# EasyEDA Pro project PCB.epro

# Board PCB1
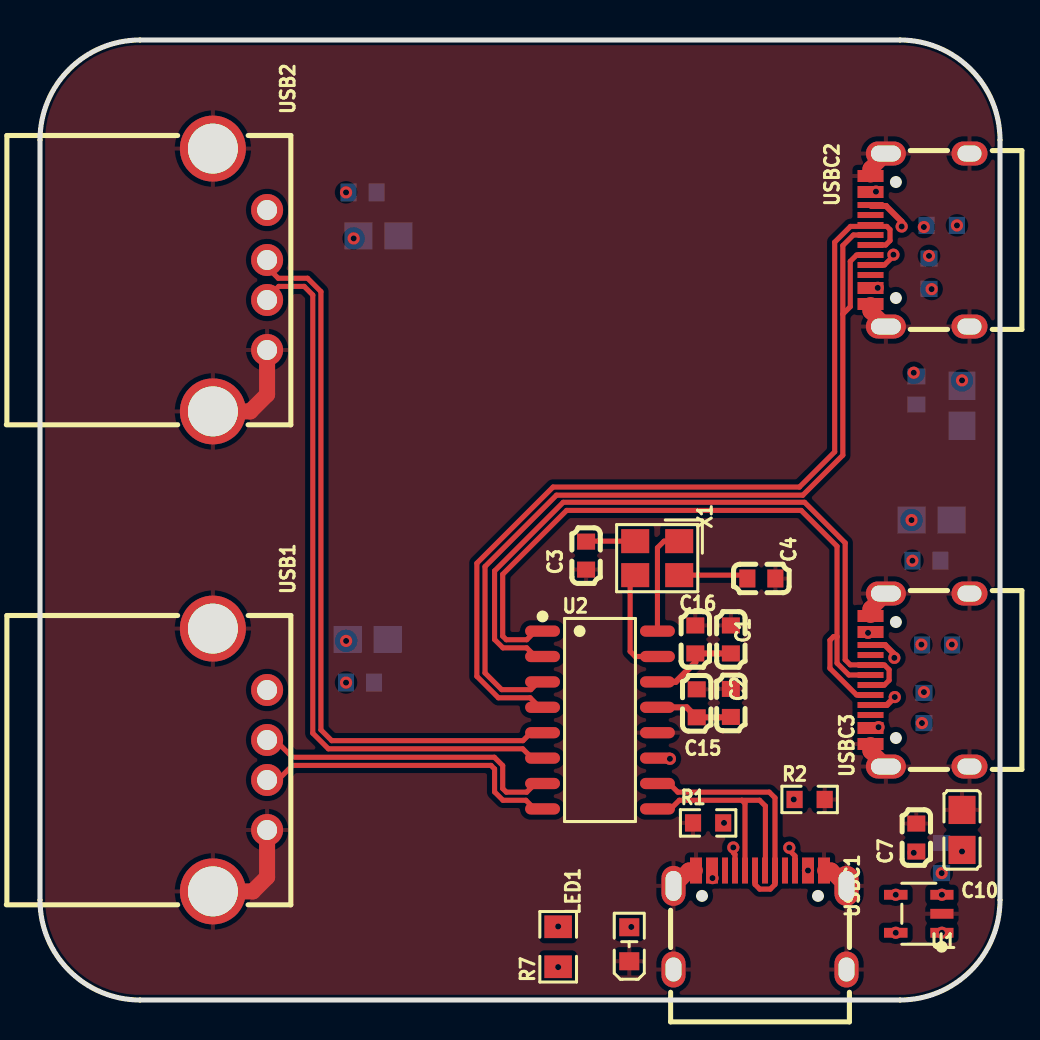
[diagram p0: board, top side]
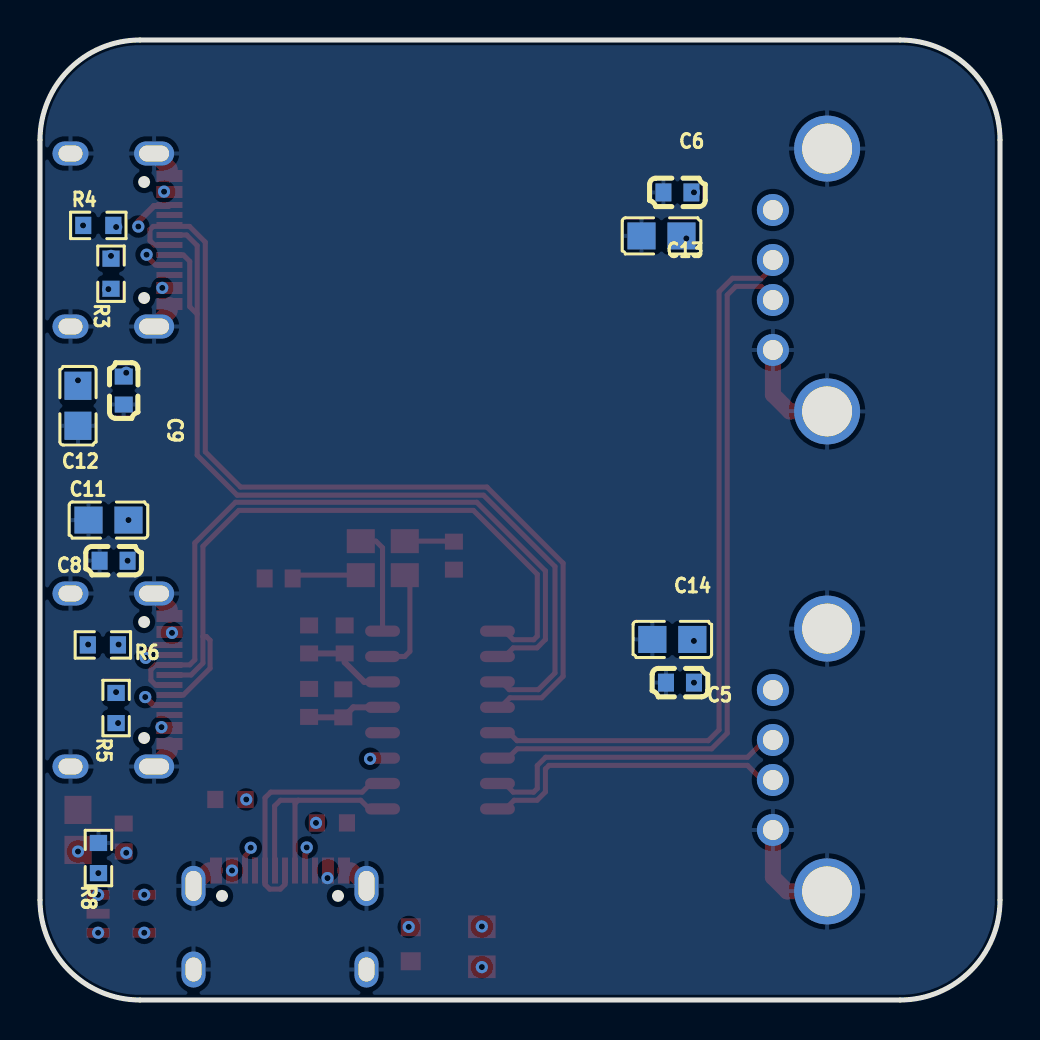
[diagram p1: board, bottom side, seen from below]

Outline 48 x 48 mm; copper layers: Top Layer, Inner1, Inner2, Bottom Layer. Coordinates in mm from the lower left corner of the outline.
Outline path: 0,43 0,5 arc(1.46,1.46) 5,0 43,0 arc(46.54,1.46) 48,5 48,43 arc(46.54,46.54) 43,48 5,48 arc(1.46,46.54) 0,43
Stack: Top Layer 0.035mm Outer layer thickness 1oz / Dielectric1 0.2104mm 7628 RC49% 8.6mil / Inner1 0.0152mm Inner layer thickness / Dielectric2 1.065mm 1.1mm H/HOZ Copper / Inner2 0.0152mm Inner layer thickness / Dielectric3 0.2104mm 7628 RC49% 8.6mil / Bottom Layer 0.035mm Outer layer thickness 1oz

## Design rules (mm)
net D+: DP1
net D-: DP1
net DP4: DP2
net DM4: DP2
net DP3: DP3
net DM3: DP3
net DP1: DP4
net DM1: DP4
net DP2: DP5
net DM2: DP5
spacing copperThickness1oz (default): track to track 0.102, other pairs 0.152 to 0.3
spacing copperThickness2oz: track to track 0.203, other pairs 0.152 to 0.3
track width copperThickness1oz (default): min 0.127, default 0.254, max 2.54
track width copperThickness2oz: min 0.203, default 0.254, max 2.54
differential pair differentialPair (default): width min 0.127, default 0.254, max 2.54; gap min 0.152, default 0.152
net GND uses copperRegion

## Placement (name value [footprint] x y rotation side)
C1  10uF  [C0603]  34.54 18.03 90 top
C2  10uF  [C0603]  34.54 14.85 90 top
C3  15pF  [C0603]  27.31 22.22 90 top
C4  15pF  [C0603]  36.07 21.08 0 top
C5  100nF  [C0603]  16 15.87 0 bottom
C6  100nF  [C0603]  16.13 40.38 0 bottom
C7  100nF  [C0603]  43.81 8.12 270 top
C8  100nF  [C0603]  44.32 21.97 180 bottom
C9  100nF  [C0603]  43.81 30.47 90 bottom
C10  10uF  [C0805]  46.1 8.5 270 top
C11  10uF  [C0805]  44.58 24 180 bottom
C12  10uF  [C0805]  46.1 29.71 90 bottom
C13  10uF  [C0805]  16.92 38.2 0 bottom
C14  10uF  [C0805]  16.38 18.03 0 bottom
C15  100nF  [C0603]  32.84 14.83 270 top
C16  100nF  [C0603]  32.77 18.03 270 top
LED1  A-SP192DGHC-C01-4T  [LED0603-FD]  29.46 2.79 270 top
R1  5.1kΩ  [R0603]  33.41 8.85 0 top
R2  5.1kΩ  [R0603]  38.48 10.03 0 top
R3  56kΩ  [R0603]  44.45 36.32 90 bottom
R4  56kΩ  [R0603]  45.09 38.73 180 bottom
R5  56kΩ  [R0603]  44.2 14.6 90 bottom
R6  56kΩ  [R0603]  44.86 17.75 180 bottom
R7  1kΩ  [R0805]  25.91 2.66 90 top
R8  4.7kΩ  [R0603]  45.08 7.1 90 bottom
U1  SY6280AAC  [SOT-23-5_L3.0-W1.7-P0.95-LS2.8-BL]  43.94 4.31 90 top
U2  SL2.1A  [SOP-16_L10.0-W3.9-P1.27-LS6.0-BL]  28 14 270 top
USB1  USB-231-ARY  [USB-A-TH_USB-231-ARY]  10 12 270 top
USB2  USB-231-ARY  [USB-A-TH_USB-231-ARY]  10 36 270 top
USBC1  TYPE-C-31-M-12  [USB-C_SMD-TYPE-C-31-M-12_1]  36 4 0 top
USBC2  TYPE-C-31-M-12  [USB-C_SMD-TYPE-C-31-M-12_1]  44 38 90 top
USBC3  TYPE-C-31-M-12  [USB-C_SMD-TYPE-C-31-M-12_1]  44 16 90 top
X1  12MHz  [CRYSTAL-SMD_4P-L3.2-W2.5-BL]  30.86 22.09 180 top

## Footprints (pads in the part's own frame, mm; a bottom-side part is the same pattern mirrored in y, then rotated)
C0603
  rect 0.8x0.9 smd: 1(-0.7,0) 2(0.7,0)
C0805
  rect 1.41x1.35 smd: 1(-1,0) 2(1,0)
CRYSTAL-SMD_4P-L3.2-W2.5-BL
  rect 1.4x1.2 smd: 1(-1.1,-0.85) 2(1.1,-0.85) 3(1.1,0.85) 4(-1.1,0.85)
LED0603-FD
  rect 0.9x1 smd: 1(-0.85,0) 2(0.85,0)
R0603
  rect 0.806x0.864 smd: 1(-0.753,0) 2(0.753,0)
R0805
  rect 1.133x1.377 smd: 1(-1,0) 2(1,0)
SOP-16_L10.0-W3.9-P1.27-LS6.0-BL
  oval 0.56x1.745 smd: 1(-4.445,-2.873) 2(-3.175,-2.873) 3(-1.905,-2.873) 4(-0.635,-2.873) 5(0.635,-2.873) 6(1.905,-2.873) 7(3.175,-2.873) 8(4.445,-2.873) 9(4.445,2.873) 10(3.175,2.873) 11(1.905,2.873) 12(0.635,2.873) 13(-0.635,2.873) 14(-1.905,2.873) 15(-3.175,2.873) 16(-4.445,2.873)
SOT-23-5_L3.0-W1.7-P0.95-LS2.8-BL
  rect 0.49x1.157 smd: 1(-0.95,-1.153) 2(0,-1.153) 3(0.95,-1.153)
  rect 0.49x1.175 smd: 4(0.95,1.153) 5(-0.95,1.153)
USB-A-TH_USB-231-ARY
  round 1.6 hole 1: 1(-3.5,1.355) 2(-1,1.355) 3(1,1.355) 4(3.5,1.355)
  round 3.3 hole 2.5: 5(-6.57,-1.355) 6(6.57,-1.355)
USB-C_SMD-TYPE-C-31-M-12_1
  oval 1.2x2 hole 0.8x1.5: 1(4.325,1.706) 4(-4.325,1.706)
  oval 1.2x1.8 hole 0.8x1.2: 2(4.325,-2.474) 3(-4.325,-2.474)
  custom 0.6x1.3 smd: A1B12(-3.2,2.474) A4B9(-2.4,2.474) B1A12(3.2,2.474) B4A9(2.401,2.474)
  rect 0.3x1.3 smd: A5(-1.25,2.474) A6(-0.25,2.474) A7(0.25,2.474) A8(1.25,2.474) B5(1.75,2.474) B6(0.75,2.474) B7(-0.75,2.474) B8(-1.75,2.474)

## Nets
+5V: C5.1 C6.1 C7.2 C8.2 C9.2 C10.2 C11.2 C12.2 C13.1 C14.1 R3.1 R4.1 R5.1 R6.1 R7.1 U1.1 U2.11 USB1.1 USB2.1 USBC2.A4B9 USBC2.B4A9 USBC3.A4B9 USBC3.B4A9
GND: C1.2 C2.2 C3.1 C4.2 C5.2 C6.2 C7.1 C8.1 C9.1 C10.1 C11.1 C12.1 C13.2 C14.2 C15.1 C16.1 LED1.2 R1.1 R2.2 R8.2 U1.2 U2.12 USB1.4 USB1.5 USB1.6 USB2.4 USB2.5 USB2.6 USBC1.1 USBC1.2 USBC1.3 USBC1.4 USBC1.A1B12 USBC1.B1A12 USBC2.1 USBC2.2 USBC2.3 USBC2.4 USBC2.A1B12 USBC2.B1A12 USBC3.1 USBC3.2 USBC3.3 USBC3.4 USBC3.A1B12 USBC3.B1A12
D+: U2.10 USBC1.A6 USBC1.B6
D-: U2.9 USBC1.A7 USBC1.B7
DM1: U2.7 USB1.2
DM2: U2.5 USB2.2
DM3: U2.3 USBC2.A7 USBC2.B7
DM4: U2.1 USBC3.A7 USBC3.B7
DP1: U2.8 USB1.3
DP2: U2.6 USB2.3
DP3: U2.4 USBC2.A6 USBC2.B6
DP4: U2.2 USBC3.A6 USBC3.B6
$1N151: C1.1 C16.2 U2.14
$1N152: C2.1 C15.2 U2.13
$1N156: U2.15 X1.3
$1N157: U2.16 X1.1
$1N158: C4.1 X1.4
$1N159: C3.2 X1.2
$1N181: R1.2 USBC1.A5
$1N182: R2.1 USBC1.B5
$1N206: R4.2 USBC2.B5
$1N207: R3.2 USBC2.A5
$1N223: R6.2 USBC3.B5
$1N224: R5.2 USBC3.A5
$1N239: LED1.1 R7.2
$1N246: U1.4 U1.5 USBC1.A4B9 USBC1.B4A9
$1N248: R8.1 U1.3

Pads without a net: USBC1 A8 B8; USBC2 A8 B8; USBC3 A8 B8

## Via types
v1: diameter 0.61, hole 0.305, Top Layer to Bottom Layer, 41 vias

## Routing (per net, layer and track width the routed paths; a pad name or vN(x,y) marks a point on that pad's centre or on a via; arc(x,y) is an arc through that point)
+5V: length 237.8
  Inner2 w0.8: 33.66,25.78 34.16,26.28 39.44,26.28 ; 33.66,25.78 33.66,29.97 33.09,30.53 28.12,30.53 28.07,30.48 ; 33.66,25.78 32.38,24.5 21.21,24.5 19.75,23.05 19.75,8.69 21.52,6.92 22.79,6.92 ; 22.79,6.92 27.5,6.92 28.07,7.49 28.07,11.17 28.96,12.06 v1(31.5,12.06) 37.08,12.06 39.62,9.52 42.29,9.52 42.7,9.11 42.7,8.35 v1(43.69,7.36) 43.75,7.43 v1(46.1,7.43) 46.54,7.43 47.12,6.85 47.12,3.93 46.55,3.36 v1(45.1,3.36) ; 22.79,6.92 22.79,2.48 23.62,1.64 v1(25.91,1.64) ; 38.74,37.81 37.05,37.81 36.19,36.95 36.19,32.89 37.72,31.36 v1(43.69,31.36) 45.72,31.36 v1(46.1,30.98) 46.1,27.08 45.3,26.28 39.44,26.28 ; 38.74,37.81 38.74,39.62 39.54,40.42 v1(41.8,40.42) 41.86,40.42 42.38,39.9 45.31,39.9 45.85,39.36 v1(45.85,38.73) ; 38.74,37.81 38.74,36.44 39.57,35.61 v1(41.89,35.61) 42.38,36.1 43.21,36.1 43.76,35.54 v1(44.58,35.54) ; v1(15.68,38.08) 15.68,40 v1(15.3,40.38) 15.05,40.63 12.06,40.63 11.35,39.92 USB2.1 ; 39.44,26.28 39.69,26.04 39.69,23.95 43.53,23.95 v1(43.58,24) 43.58,22.01 v1(43.62,21.97) 37.47,21.97 36.58,21.08 36.58,16.89 37.34,16.12 38.48,16.12 ; v1(44.1,13.85) 43.82,14.13 42.41,14.13 v1(41.93,13.64) ; v1(41.4,18.36) 41.4,18.28 ; 41.4,18.28 41.72,17.96 41.72,16.82 42.29,16.25 44.83,16.25 45.59,17.01 v1(45.59,17.77) ; 41.4,18.28 39.37,18.28 38.8,17.71 38.8,14.54 39.75,13.58 41.87,13.58 ; 28.07,30.48 28.07,31.62 27.18,32.51 16.55,32.51 15.75,33.31 15.75,37.84 ; 28.07,30.48 28.07,27.59 27.4,26.92 16.38,26.92 15.31,25.84 v1(15.31,17.95) 15.31,15.87 v1(15.3,15.87) 14.93,15.5 USB1.1
GND: length 19
  Top Layer w0.8: USBC3.4 41.53,12.44 41.53,12.75 ; USB1.4 11.35,6.14 10.64,5.43 USB1.6 ; USBC1.4 32.44,6.47 32.74,6.47 ; USB2.6 10.51,29.43 11.35,30.27 USB2.4 ; 41.53,34.75 41.53,34.44 USBC2.4 ; USBC3.1 41.53,19.56 41.53,19.25 ; USBC1.1 39.56,6.47 39.26,6.47 ; 41.53,41.28 41.53,41.56 USBC2.1
D+: length 12.4
  Top Layer w0.254: U2.10 31.46,10.83 31.89,10.39 36.46,10.39 36.75,10.11 USBC1.B6 36.75,5.78 36.52,5.55 35.98,5.55 35.75,5.78 USBC1.A6
D-: length 12.5
  Top Layer w0.254: USBC1.B7 35.25,9.83 35.09,9.99 ; U2.9 31.53,9.56 31.96,9.99 35.09,9.99 ; 35.09,9.99 35.98,9.99 36.27,9.7 36.27,6.49 USBC1.A7
DM1: length 15.7
  Top Layer w0.254: U2.7 24.77,10.83 24.34,10.39 23.31,10.39 23.14,10.57 23.14,11.72 22.72,12.14 12.62,12.14 11.76,13 USB1.2
DM2: length 36.9
  Top Layer w0.254: U2.5 24.55,13.36 24.15,12.97 14.59,12.97 14.05,13.51 14.05,35.42 13.38,36.09 11.91,36.09 11.35,36.64 USB2.2
DM3: length 44.9
  Top Layer w0.254: U2.3 24.93,15.91 24.54,15.52 23.08,15.52 22.25,16.35 22.25,21.67 25.82,25.24 38.14,25.24 40.14,27.24 40.14,34.29 ; USBC2.B7 40.83,37.25 40.51,36.93 40.51,34.67 40.14,34.29 ; 40.14,34.29 40.14,37.72 40.67,38.25 USBC2.A7
DM4: length 36.2
  Top Layer w0.254: 39.85,18.17 39.68,18.17 39.5,17.99 39.5,16.58 40.83,15.25 USBC3.B7 ; 39.85,18.17 39.85,22.69 38.06,24.48 26.33,24.48 23.14,21.28 23.14,18.19 23.31,18.01 24.34,18.01 24.77,18.44 U2.1 ; 39.85,18.17 39.85,16.84 40.45,16.25 41.38,16.25
DP1: length 15.6
  Top Layer w0.254: USB1.3 11.9,11 12.63,11.73 22.55,11.73 22.73,11.55 22.73,10.4 23.15,9.99 24.29,9.99 24.72,9.56 U2.8
DP2: length 36.7
  Top Layer w0.254: USB2.3 11.35,35.1 11.94,35.68 13.21,35.68 13.64,35.25 13.64,13.34 14.42,12.56 24.14,12.56 24.6,12.09 U2.6
DP3: length 45
  Top Layer w0.254: U2.4 24.98,14.64 24.51,15.11 22.92,15.11 21.84,16.18 21.84,21.84 25.65,25.65 37.97,25.65 39.74,27.41 39.74,37.89 40.52,38.68 42.34,38.68 42.5,38.52 42.5,37.97 42.28,37.75 USBC2.A6
DP4: length 36.2
  Top Layer w0.254: USBC3.A6 41.53,15.74 42.21,15.74 42.46,15.98 42.46,16.52 42.22,16.75 USBC3.B6 ; U2.2 24.77,17.17 24.34,17.61 23.15,17.61 22.73,18.02 22.73,21.45 26.16,24.89 38.23,24.89 40.26,22.85 40.26,17.01 40.51,16.76 41.93,16.76
$1N151: length 4.5
  Top Layer w0.3: U2.14 31.79,15.91 32.77,16.89 C16.2 C1.1
$1N152: length 3.9
  Top Layer w0.3: U2.13 32.33,14.64 C15.2 34.53,14.13 C2.1
$1N156: length 5.4
  Top Layer w0.254: X1.3 29.51,20.99 29.51,17.43 29.76,17.17 U2.15
$1N157: length 5.4
  Top Layer w0.254: X1.1 31.2,22.94 30.87,22.61 U2.16
$1N158: length 3.5
  Top Layer w0.254: X1.4 35.2,21.24 C4.1
$1N159: length 2.5
  Top Layer w0.254: C3.2 27.33,22.94 X1.2
$1N181: length 2.6
  Top Layer w0.254: v1(34.66,7.63) 34.66,7.37 34.75,7.28 USBC1.A5
  Inner2 w0.6: v1(34.2,8.85) 34.2,8.09 v1(34.66,7.63)
$1N182: length 3.9
  Top Layer w0.254: USBC1.B5 37.75,7.2 37.47,7.49 v1(37.47,7.61)
  Inner2 w0.6: v1(37.47,7.61) 37.34,7.74 37.34,9.68 v1(37.69,10.03)
$1N206: length 3.3
  Top Layer w0.3: USBC2.B5 41.57,39.7 42.3,39.7 43.08,38.92 v1(43.08,38.67)
  Inner2 w0.8: v1(44.19,38.65) 44.17,38.67 v1(43.08,38.67)
$1N207: length 3.2
  Top Layer w0.254: v1(42.67,37.27) 42.67,37.2 42.22,36.75 USBC2.A5
  Inner2 w0.8: v1(44.45,37.2) 42.73,37.2 v1(42.67,37.27)
$1N223: length 3.2
  Top Layer w0.3: USBC3.B5 42.25,17.75 42.72,17.29 v1(42.72,17.11)
  Inner2 w0.6: v1(42.72,17.11) 43.4,17.11 v1(44.07,17.77)
$1N224: length 2.9
  Top Layer w0.3: USBC3.A5 42.34,14.75 v1(42.74,15.15)
  Inner2 w0.6: v1(42.74,15.15) 43.95,15.15 v1(44.2,15.39)
$1N239: length 3.7
  Inner2 w0.8: v1(29.56,3.65) 29.54,3.68 v1(25.91,3.68)
$1N246: length 20.3
  Inner2 w0.8: v1(33.62,6.1) 35.57,4.15 40.9,4.15 41.69,3.36 v1(42.79,3.36) 43.29,3.86 43.29,4.76 v1(42.79,5.26) 42.1,5.26 41.66,5.71 41.66,7.36 41.02,8 38.96,8 38.4,7.43 v1(38.4,6.47)
$1N248: length 1.1
  Inner2 w0.8: v1(45.1,5.26) 45.09,5.27 v1(45.09,6.34)

## Copper pours and planes (outline as drawn; the poured copper is in the pictures)
GND on Top Layer: -5.59,49.65 55.25,49.65 55.25,-5.85 -5.59,-5.85
GND on Bottom Layer: -16.89,61.08 72.9,61.08 72.9,-12.45 -16.89,-12.45
GND on Inner1: -35.31,71.11 82.42,71.11 82.42,-11.06 -35.31,-11.06
